# Altium schematic sheet 主图.SchDoc
size A4
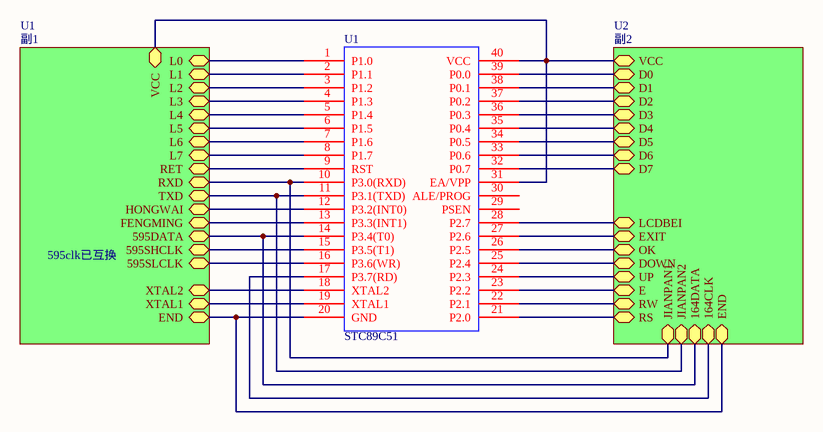
[diagram p0: 主图.SchDoc]

## Parts
U1  STC89C51  [DIP_40]

## Sub-sheets
U1 = 副1: RET, RXD, TXD, HONGWAI, FENGMING, 595DATA, 595SHCLK, 595SLCLK, XTAL2, XTAL1, END, L0, L1, L2, L3, L4, L5, L6, L7, VCC
U2 = 副2: VCC, D0, D1, D2, D3, D4, D5, D6, D7, LCDBEI, EXIT, OK, DOWN, UP, E, RW, RS, JIANPAN1, JIANPAN2, 164DATA, 164CLK, END

## Nets
NetU1_1: U1.1(P1.0) ; sheet U1/L0
NetU1_2: U1.2(P1.1) ; sheet U1/L1
NetU1_3: U1.3(P1.2) ; sheet U1/L2
NetU1_4: U1.4(P1.3) ; sheet U1/L3
NetU1_5: U1.5(P1.4) ; sheet U1/L4
NetU1_6: U1.6(P1.5) ; sheet U1/L5
NetU1_7: U1.7(P1.6) ; sheet U1/L6
NetU1_8: U1.8(P1.7) ; sheet U1/L7
NetU1_9: U1.9(RST) ; sheet U1/RET
NetU1_10: U1.10(P3.0(RXD)) ; sheet U1/RXD, sheet U2/JIANPAN1
NetU1_11: U1.11(P3.1(TXD)) ; sheet U1/TXD, sheet U2/JIANPAN2
NetU1_12: U1.12(P3.2(INT0)) ; sheet U1/HONGWAI
NetU1_13: U1.13(P3.3(INT1)) ; sheet U1/FENGMING
NetU1_14: U1.14(P3.4(T0)) ; sheet U1/595DATA, sheet U2/164DATA
NetU1_15: U1.15(P3.5(T1)) ; sheet U1/595SHCLK
NetU1_16: U1.16(P3.6(WR)) ; sheet U1/595SLCLK
NetU1_17: U1.17(P3.7(RD)) ; sheet U2/164CLK
NetU1_18: U1.18(XTAL2) ; sheet U1/XTAL2
NetU1_19: U1.19(XTAL1) ; sheet U1/XTAL1
NetU1_20: U1.20(GND) ; sheet U1/END, sheet U2/END
NetU1_21: U1.21(P2.0) ; sheet U2/RS
NetU1_22: U1.22(P2.1) ; sheet U2/RW
NetU1_23: U1.23(P2.2) ; sheet U2/E
NetU1_24: U1.24(P2.3) ; sheet U2/UP
NetU1_25: U1.25(P2.4) ; sheet U2/DOWN
NetU1_26: U1.26(P2.5) ; sheet U2/OK
NetU1_27: U1.27(P2.6) ; sheet U2/EXIT
NetU1_28: U1.28(P2.7) ; sheet U2/LCDBEI
NetU1_31: U1.31(EA/VPP) U1.40(VCC) ; sheet U1/VCC, sheet U2/VCC
NetU1_32: U1.32(P0.7) ; sheet U2/D7
NetU1_33: U1.33(P0.6) ; sheet U2/D6
NetU1_34: U1.34(P0.5) ; sheet U2/D5
NetU1_35: U1.35(P0.4) ; sheet U2/D4
NetU1_36: U1.36(P0.3) ; sheet U2/D3
NetU1_37: U1.37(P0.2) ; sheet U2/D2
NetU1_38: U1.38(P0.1) ; sheet U2/D1
NetU1_39: U1.39(P0.0) ; sheet U2/D0

Not connected (* = marked no-connect by the designer): U1 29(PSEN) 30(ALE/PROG)

## Notes on the sheet
- 595clk已互换